# Altium schematic sheet BQ25756 Data Config.SchDoc
size A4; Organization: TESLA Motors, INC; Address1: 3500 Deer Creek Road; Address2: Palo Alto, CA; Address4: U.S.A.; SheetNumber: 8; SheetTotal: 14
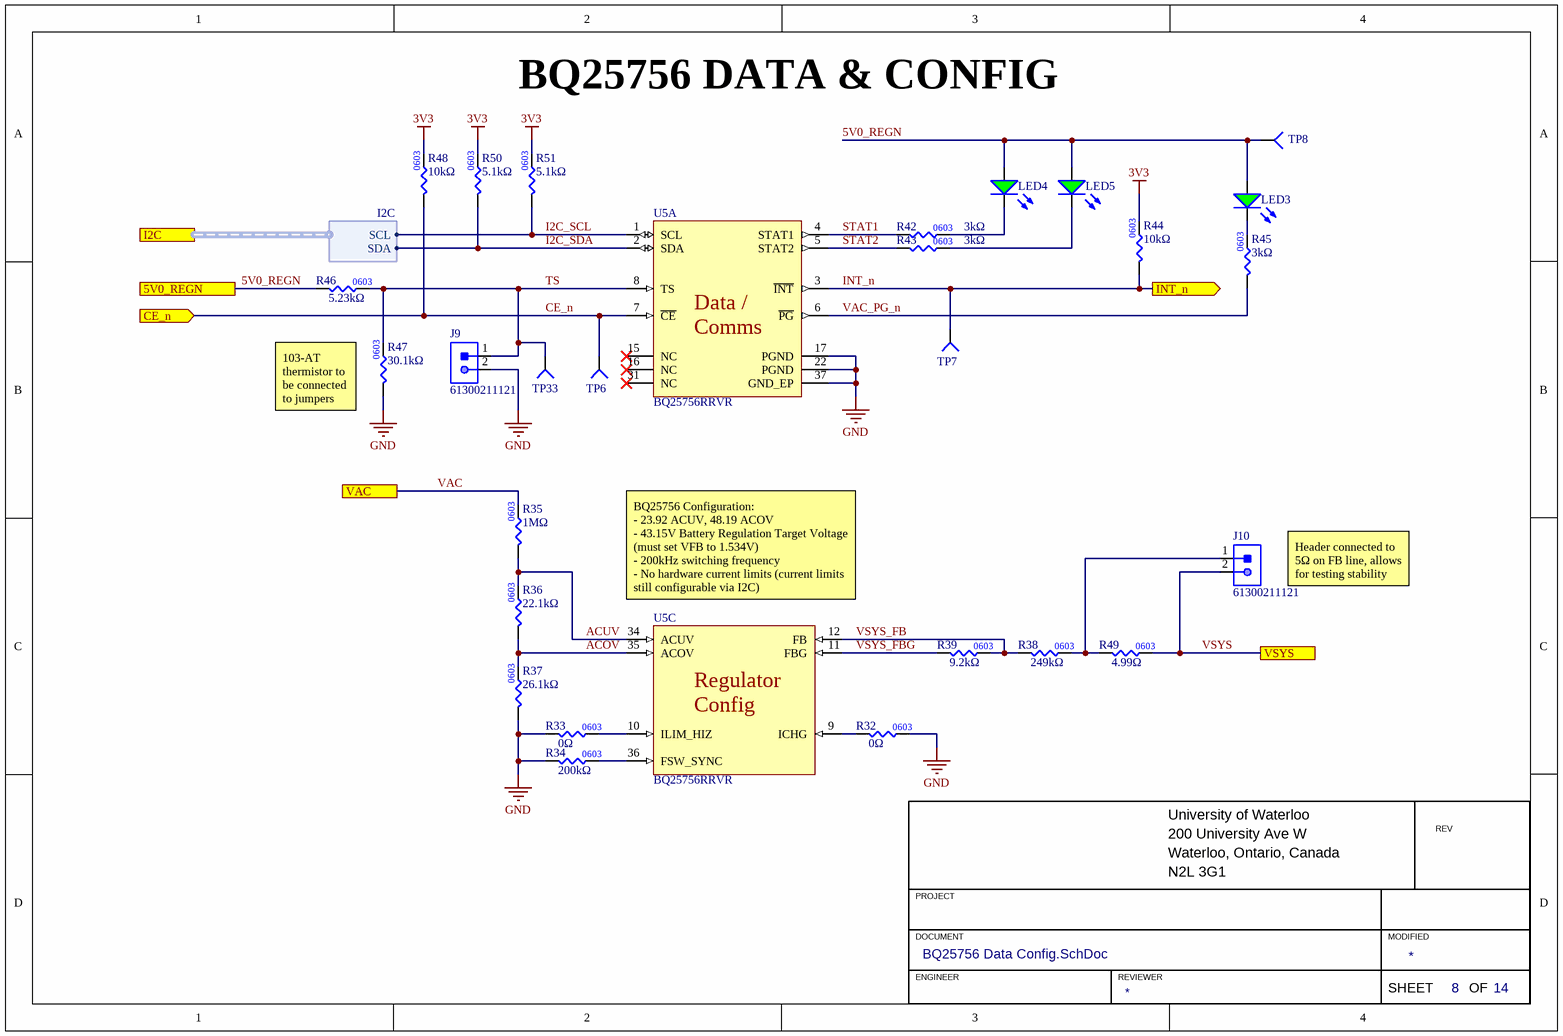
[diagram p0: BQ25756 Data Config.SchDoc]

## Parts
J9  Manufacturer Part Number 1: 61300211121  [HDR1X2]  (hidden comment: HEADER 2x1)
J10  Manufacturer Part Number 1: 61300211121  [HDR1X2]  (hidden comment: HEADER 2x1)
LED3  LED_GREEN_0805  [LED_0805_GREEN]  (value not drawn)
LED4  LED_GREEN_0805  [LED_0805_GREEN]  (value not drawn)
LED5  LED_GREEN_0805  [LED_0805_GREEN]  (value not drawn)
R32  value 0Ω  [RES0603]  (hidden comment: RES_0Ω_0603)
R33  value 0Ω  [RES0603]  (hidden comment: RES_0Ω_0603)
R34  value 200kΩ  [RES0603]  (hidden comment: RES_200kΩ_0603_1%)
R35  value 1MΩ  [RES0603]  (hidden comment: RES_1MΩ_0603_1%)
R36  value 22.1kΩ  [RES0603]  (hidden comment: RES_22.1kΩ_0603_1%)
R37  value 26.1kΩ  [RES0603]  (hidden comment: RES_26.1kΩ_0603_1%)
R38  value 249kΩ  [RES0603]  (hidden comment: RES_249kΩ_0603_1%)
R39  value 9.2kΩ  [RES0603]  (hidden comment: RES_9.2kΩ_0603_0.1%)
R42  value 3kΩ  [RES0603]  (hidden comment: RES_3kΩ_0603_1%)
R43  value 3kΩ  [RES0603]  (hidden comment: RES_3kΩ_0603_1%)
R44  value 10kΩ  [RES0603]  (hidden comment: RES_10kΩ_0603_1%)
R45  value 3kΩ  [RES0603]  (hidden comment: RES_3kΩ_0603_1%)
R46  value 5.23kΩ  [RES0603]  (hidden comment: RES_5.23kΩ_0603_0.1%)
R47  value 30.1kΩ  [RES0603]  (hidden comment: RES_30.1kΩ_0603_0.1%)
R48  value 10kΩ  [RES0603]  (hidden comment: RES_10kΩ_0603_1%)
R49  value 4.99Ω  [RES0603]  (hidden comment: RES_4.99Ω_0603_1%)
R50  value 5.1kΩ  [RES0603]  (hidden comment: RES_5.1kΩ_0603_1%)
R51  value 5.1kΩ  [RES0603]  (hidden comment: RES_5.1kΩ_0603_1%)
TP6  TESTPOINT_1MM_CIRCLE  [TESTPOINT_CIRCLE_1MM]  (value not drawn)  (no BOM)
TP7  TESTPOINT_1MM_CIRCLE  [TESTPOINT_CIRCLE_1MM]  (value not drawn)  (no BOM)
TP8  TESTPOINT_1MM_SQUARE  [TESTPOINT_SQUARE_1MM]  (value not drawn)  (no BOM)
TP33  TESTPOINT_1MM_CIRCLE  [TESTPOINT_CIRCLE_1MM]  (value not drawn)  (no BOM)
U5  BQ25756RRVR  [TI_36-VQFN]  (parts A,C of 3)

## Ports
5V0_REGN, CE_n (in), I2C (harness I2C), INT_n (out), VAC, VSYS

## Harnesses
I2C: SCL, SDA

## Nets
3V3: R44.2 R48.2 R50.2 R51.2
GND: J9.2 R32.2 R33.1 R34.1 R37.1 R47.1 U5.17(PGND) U5.22(PGND) U5.37(GND_EP)
5V0_REGN: LED3.1(A) LED4.1(A) LED5.1(A) R46.1 TP8.1(=value) ; port 5V0_REGN
ACOV: R36.1 R37.2 U5.35(ACOV)
ACUV: R35.1 R36.2 U5.34(ACUV)
CE_n: R48.1 TP6.1(=value) U5.7(~{CE}) ; port CE_n
I2C_SCL: R51.1 U5.1(SCL) ; port I2C.SCL
I2C_SDA: R50.1 U5.2(SDA) ; port I2C.SDA
INT_n: R44.1 TP7.1(=value) U5.3(~{INT}) ; port INT_n
STAT1: R42.1 U5.4(STAT1)
STAT2: R43.1 U5.5(STAT2)
TS: J9.1(VCC) R46.2 R47.2 TP33.1(=value) U5.8(TS)
VAC: R35.2 ; port VAC
VAC_PG_n: R45.1 U5.6(~{PG})
VSYS: J10.2 R49.2 ; port VSYS
VSYS_FB: R38.1 R39.2 U5.12(FB)
VSYS_FBG: R39.1 U5.11(FBG)
NetJ10_1: J10.1(VCC) R38.2 R49.1
NetLED3_2: LED3.2(K) R45.2
NetLED4_2: LED4.2(K) R42.2
NetLED5_2: LED5.2(K) R43.2
NetR32_1: R32.1 U5.9(ICHG)
NetR33_2: R33.2 U5.10(ILIM_HIZ)
NetR34_2: R34.2 U5.36(FSW_SYNC)

Not connected (* = marked no-connect by the designer): U5 15(NC)* 16(NC)* 31(NC)*

## Notes on the sheet
- BQ25756 DATA & CONFIG
- (near R47) 103-AT thermistor to be connected to jumpers
- Header connected to 5Ω on FB line, allows for testing stability
- (near U5) BQ25756 Configuration:
  - 23.92 ACUV, 48.19 ACOV
  - 43.15V Battery Regulation Target Voltage (must set VFB to 1.534V)
  - 200kHz switching frequency
  - No hardware current limits (current limits still configurable via I2C)
- University of Waterloo
- 200 University Ave W
- REV
- PROJECT
- Waterloo, Ontario, Canada
- N2L 3G1
- DOCUMENT
- ENGINEER
- REVIEWER
- MODIFIED
- SHEET
- OF
- (in symbol BQ25756RRVR, part A) Data / / Comms
- (in symbol BQ25756RRVR, part C) Regulator / Config
- (in symbol RES_3kΩ_0603_1%) 0603
- (in symbol RES_9.2kΩ_0603_0.1%) 0603
- (in symbol RES_22.1kΩ_0603_1%) 0603
- (in symbol RES_26.1kΩ_0603_1%) 0603
- (in symbol RES_249kΩ_0603_1%) 0603

## Library data of the parts
J9 J10 = HEADER 2x1: Manufacturer 1: Würth Elektronik; Package/Footprint: TH; Mounting Type: TH; Supplier 1: Digi-Key; Supplier Part Number 1: 732-5315-ND
LED3-LED5 = LED_GREEN_0805: LED GREEN DIFFUSED 0805 SMD; Manufacturer 1: OSRAM; Manufacturer Part Number 1: LG R971-KN-1; Forward Voltage Drop: 2.2V; Package/Footprint: 0805; Supplier Part Number 1: 475-1410-1-ND; Supplier 1: Digi-Key; Mounting Type: SMD
R32 R33 = RES_0Ω_0603: RES 0 OHM JUMPER 1/10W 0603; Manufacturer 1: Yageo; Manufacturer Part Number 1: RC0603JR-070RL; Supplier Part Number 1: 311-0.0GRCT-ND; Supplier 1: Digi-Key; Mounting Type: SMD; Package: 0603
R34 = RES_200kΩ_0603_1%: RES 200K OHM 1% 1/10W 0603; Manufacturer 1: YAGEO; Manufacturer Part Number 1: RC0603FR-13200KL; Package/Footprint: 0603; Supplier Part Number 1: 13-RC0603FR-13200KLCT-ND; Supplier 1: Digi-Key; Mounting Type: SMD
R35 = RES_1MΩ_0603_1%: RES 1M OHM 1% 1/10W 0603; Manufacturer 1: YAGEO; Manufacturer Part Number 1: RC0603FR-071ML; Supplier Part Number 1: 311-1.00MHRCT-ND; Supplier 1: Digi-Key; Mounting Type: SMD; Package: 0603
R36 = RES_22.1kΩ_0603_1%: RES 22.1K OHM 1% 1/10W 0603; Manufacturer 1: Stackpole Electronics Inc; Manufacturer Part Number 1: RMCF0603FT22K1; Supplier 1: Digi-Key; Supplier Part Number 1: RMCF0603FT22K1CT-ND
R37 = RES_26.1kΩ_0603_1%: RES 26.1K OHM 1% 1/10W 0603; Manufacturer 1: Yageo; Manufacturer Part Number 1: RC0603FR-0726K1L; Supplier Part Number 1: 311-26.1KHRCT-ND; Supplier 1: Digi-Key
R38 = RES_249kΩ_0603_1%: RES 249K OHM 1% 1/10W 0603; Manufacturer 1: Stackpole Electronics Inc; Manufacturer Part Number 1: RMCF0603FT249K; Supplier Part Number 1: RMCF0603FT249KCT-ND; Supplier 1: Digi-Key
R39 = RES_9.2kΩ_0603_0.1%: RES 9.2K OHM 0.1% 1/10W 0603; Manufacturer 1: YAGEO; Manufacturer Part Number 1: RT0603BRD079K2L; Supplier Part Number 1: 13-RT0603BRD079K2LCT-ND; Supplier 1: Digi-Key
R42 R43 R45 = RES_3kΩ_0603_1%: RES 3K OHM 1% 1/10W 0603; Manufacturer 1: Yageo; Manufacturer Part Number 1: RC0603FR-073KL; Supplier Part Number 1: 311-3.00KHRCT-ND; Supplier 1: Digi-Key
R44 R48 = RES_10kΩ_0603_1%: RES 10K OHM 1% 1/8W 0603; Manufacturer 1: Stackpole Electronics Inc; Manufacturer Part Number 1: RNCP0603FTD10K0; Supplier Part Number 1: RNCP0603FTD10K0CT-ND; Supplier 1: Digi-Key; Mounting Type: SMD; Package: 0603
R46 = RES_5.23kΩ_0603_0.1%: RES SMD 5.23KOHM 0.1% 1/10W 0603; Manufacturer 1: YAGEO; Manufacturer Part Number 1: RT0603BRE075K23L; Mounting Type: SMD; Package: 0603; Supplier 1: Digi-Key; Supplier Part Number 1: YAG4758CT-ND
R47 = RES_30.1kΩ_0603_0.1%: RES SMD 30.1KOHM 0.1% 1/10W 0603; Manufacturer 1: YAGEO; Manufacturer Part Number 1: RT0603BRD0730K1L; Mounting Type: SMD; Package: 0603; Supplier 1: Digi-Key; Supplier Part Number 1: YAG1631CT-ND
R49 = RES_4.99Ω_0603_1%: RES 4.99 OHM 1% 1/10W 0603; Manufacturer 1: YAGEO; Manufacturer Part Number 1: RC0603FR-074R99L; Mounting Type: SMD; Package: 0603; Supplier 1: Digikey; Supplier Part Number 1: 311-4.99HRCT-ND
R50 R51 = RES_5.1kΩ_0603_1%: RES 5.1K OHM 1% 1/10W 0603; Manufacturer 1: YAGEO; Manufacturer Part Number 1: RC0603FR-135K1L; Mounting Type: SMD; Package: 0603; Supplier 1: Digi-Key; Supplier Part Number 1: 13-RC0603FR-135K1LCT-ND
TP6 TP7 TP33 = TESTPOINT_1MM_CIRCLE: TESTPOINT 1MM CIRCLE
TP8 = TESTPOINT_1MM_SQUARE: TESTPOINT 1MM SQUARE
U5 = BQ25756RRVR: IC BATT CHARGER BUCK-BOOST CTRLR; Manufacturer 1: Texas Instruments; Package/Footprint: 36-VQFN; Supplier 1: Digikey; Supplier Part Number 1: 296-BQ25756RRVRCT-ND; Manufacturer Part Number 1: BQ25756RRVR